# Altium schematic sheet Microcontroller.SchDoc
size A4; SheetNumber: 3; SheetTotal: 4
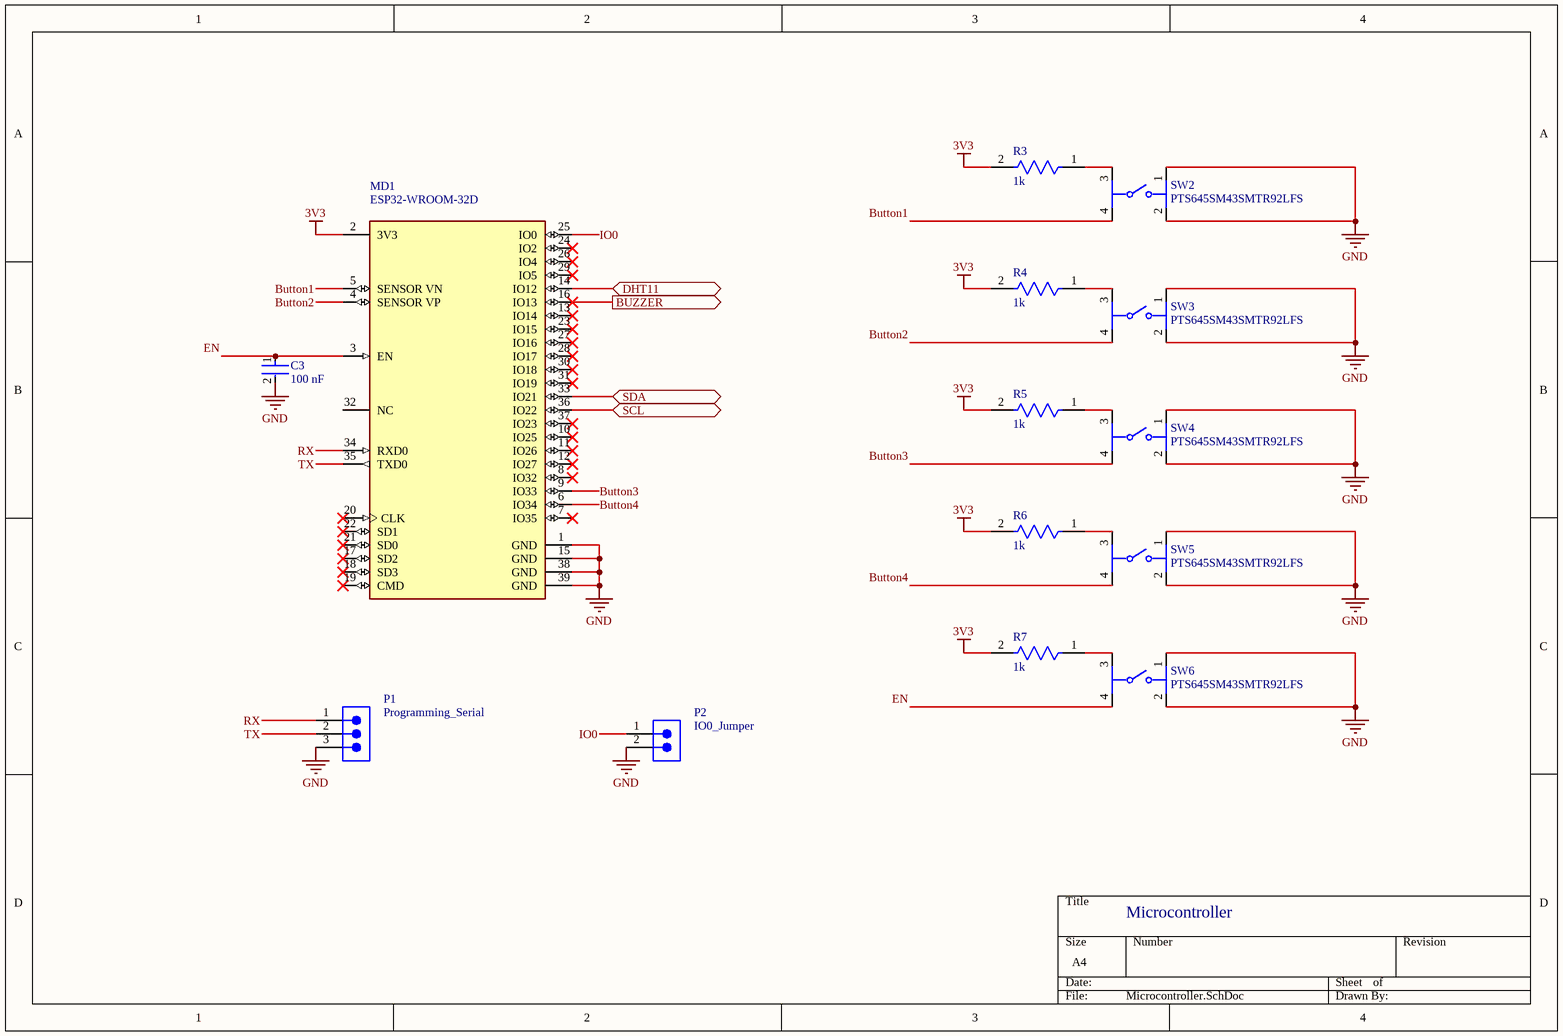
[diagram p0: Microcontroller.SchDoc]

## Parts
C3  100 nF  [FP-CC1206-1_25-MFG]
MD1  ESP32-WROOM-32D  [FP-ESP32-WROOM-32D-MFG]
P1  Programming_Serial  [61900311121]
P2  IO0_Jumper  [61300211121]
R3  1k  [FP-CRCW1206-e3-MFG]
R4  1k  [FP-CRCW1206-e3-MFG]
R5  1k  [FP-CRCW1206-e3-MFG]
R6  1k  [FP-CRCW1206-e3-MFG]
R7  1k  [FP-CRCW1206-e3-MFG]
SW2  PTS645SM43SMTR92LFS  [FP-PTS645SM43SMTR92LFS-MFG]
SW3  PTS645SM43SMTR92LFS  [FP-PTS645SM43SMTR92LFS-MFG]
SW4  PTS645SM43SMTR92LFS  [FP-PTS645SM43SMTR92LFS-MFG]
SW5  PTS645SM43SMTR92LFS  [FP-PTS645SM43SMTR92LFS-MFG]
SW6  PTS645SM43SMTR92LFS  [FP-PTS645SM43SMTR92LFS-MFG]

## Ports
BUZZER (out, see Sensors_Actuators[3B]), DHT11 (bidir, see Sensors_Actuators[1C]), SCL (bidir, see Sensors_Actuators[1B]), SDA (bidir, see Sensors_Actuators[1A])

## Nets
3V3: MD1.2(3V3) R3.2 R4.2 R5.2 R6.2 R7.2
GND: C3.2 MD1.1(GND) MD1.15(GND) MD1.38(GND) MD1.39(GND) P1.3 P2.2 SW2.1 SW2.2 SW3.1 SW3.2 SW4.1 SW4.2 SW5.1 SW5.2 SW6.1 SW6.2
Button1: MD1.5(SENSOR_VN) SW2.4
Button2: MD1.4(SENSOR_VP) SW3.4
Button3: MD1.9(IO33) SW4.4
Button4: MD1.6(IO34) SW5.4
BUZZER: MD1.16(IO13) ; port BUZZER
DHT11: MD1.14(IO12) ; port DHT11
EN: C3.1 MD1.3(EN) SW6.4
IO0: MD1.25(IO0) P2.1
RX: MD1.34(RXD0) P1.1
SCL: MD1.36(IO22) ; port SCL
SDA: MD1.33(IO21) ; port SDA
TX: MD1.35(TXD0) P1.2
NetR3_1: R3.1 SW2.3
NetR4_1: R4.1 SW3.3
NetR5_1: R5.1 SW4.3
NetR6_1: R6.1 SW5.3
NetR7_1: R7.1 SW6.3

Not connected (* = marked no-connect by the designer): MD1 7(IO35)* 8(IO32)* 10(IO25)* 11(IO26)* 12(IO27)* 13(IO14)* 17(SD2)* 18(SD3)* 19(CMD)* 20(CLK)* 21(SD0)* 22(SD1)* 23(IO15)* 24(IO2)* 26(IO4)* 27(IO16)* 28(IO17)* 29(IO5)* 30(IO18)* 31(IO19)* 32(NC) 37(IO23)*

## Notes on the sheet
- Microcontroller

## Library data of the parts
C3 = CMP-03422-000842-1: CAP CER 0.1UF 50V X7R 1206; Manufacturer: Yageo; Manufacturer Part Number: CC1206KRX7R9BB104; Automotive Grade: NA; Tolerance: 0.1; Material: Ceramic; Temperature Coefficient: 15%; Temperature Characteristic: X7R; Device Class L1: Passive Components; Lead Free: Yes; Octopart: https://octopart.com/cc1206krx7r9bb104-yageo-39467816; Category: Cap; Value: 100 nF; Temperature Range Low: -55°C; Device Class L3: Ceramic Capacitors; Voltage Rating: 50 V; Temperature Range High: +125°C; Device Class L2: Capacitors; RoHS: TRUE; Package: CC1206-1.25; Footprint Url: http://www.yageo.com/exep/pages/download/literatures/UPY-C_GEN_24.pdf; ComponentLink2Description: Datasheet; Temperature: -55°C to +125°C; Capacitance: 100 nF; Digikey Description: CAP CER 0.1UF 50V X7R 1206; Height: 1.45mm; Automotive: No; Mouser Description: Multilayer Ceramic Capacitors MLCC - SMD/SMT 100nF 50V X7R 10%; ComponentLink2URL: http://www.yageo.com/documents/recent/UPY-NP0X7R_HV_1KV-to-3KV_11.pdf
MD1 = CMP-194065-000003-1: WIFI MODULE 32MBITS SPI FLASH; Manufacturer: Espressif Systems; Max Supply Voltage: 3.6V; Nominal Supply Current: 500mA; Max Frequency: 2484MHz; Number Of Adc Channels: 16; Number Of Gpio: 32; Interface: I2C,SPI,UART,Ethernet,I2S,Other; Data Rate: 150Mbits/s; Min Supply Voltage: 3V; Bandwidth: 72MHz; Sensitivity: -98dBm; Octopart: https://octopart.com/esp32-wroom-32d-espressif+systems-91040050; Package: ESP32-WROOM-32D; ComponentLink2URL: https://www.espressif.com/sites/default/files/documentation/esp32-wroom-32d_esp32-wroom-32u_datasheet_en.pdf; Lead Free: Yes; Category: UNK; Mouser Description: Wi-Fi/BT BLE Module ESP32-D0WD, SPI Flash, UART, P; Device Class L1: Integrated Circuits (ICs); RoHS: TRUE; Temperature Range Low: -40°C; ComponentLink2Description: Datasheet; Digikey Description: WIFI MODULE 32MBITS SPI FLASH; Height: 3.2mm; Temperature: -40°C to +85°C; Manufacturer Part Number: ESP32-WROOM-32D; Device Class L3: Transceivers; Device Class L2: RF Semiconductors and Devices; Temperature Range High: +85°C; Automotive: No
P1 = CMP-1502-00585-2: NexarPartId: 18818222; Current Rating: 3A; Voltage Rating: 250V; Number of Positions: 3; Insulation Resistance: 1GΩ; Gender: Male; Pitch: 2.54mm; Connector Type: Male Pin; Contact Resistance: 20mΩ; Termination: Through Hole; Width: 7.66mm; Contact Plating: Tin; Orientation: Vertical; Mount: Through Hole; Contact Gender: Male; Max Operating Temperature: 105°C; Length: 7.62mm; Number of Rows: 1; Height: 12.5mm; Lead Pitch: 2.54mm; Housing Material: Nylon; Color: Beige; Contact Material: Copper; Fastening Type: Friction; Min Operating Temperature: -40°C; Number of Contacts: 3; Number of Pins: 3; Flammability Rating: UL94 V-0; Contact Mating Length: 7.493mm; RoHS: Compliant; REACH SVHC: Unknown; Packaging: Bulk; Operating Supply Voltage: 250V
P2 = CMP-1712-00002-6: NexarPartId: 20081794; Number of Contacts: 2; Pitch: 2.54mm; Connector Type: Male Pin; Voltage Rating: 250V; Current Rating: 3A; Gender: Male; Contact Resistance: 20mΩ; Height: 8.94mm; Lead Free: Lead Free; Number of Pins: 2; Termination: Through Hole; RoHS: Compliant; Lead Pitch: 2.54mm; REACH SVHC: No SVHC; Housing Material: PBT; Contact Mating Length: 5.9944mm; Min Operating Temperature: -40°C; Orientation: Vertical; Contact Material: Copper; Contact Gender: Male; Max Operating Temperature: 125°C; Number of Rows: 1; Number of Positions: 2; Packaging: Bulk; Contact Plating: Gold; Mount: Through Hole; Color: Black; Operating Supply Voltage: 250V
R3-R7 = CMP-2003-01876-2: RES Thick Film, 1.2kΩ, 1%, 0.25W, 100ppm/°C, 1206; Voltage Rating (DC): 200V; Power Rating: 250mW; Resistance: 1.2kR; Temperature Coefficient: 100ppm/°C; Features: Automotive AEC-Q200; Lead Free: Lead Free; Termination: SMD/SMT; Composition: Thick Film; Length: 3.2mm; Width: 0.063inch; Case Code (Imperial): 1206; Contact Plating: Tin; Number of Terminations: 2; Height: 0.55mm; Depth: 1.6mm; Max Operating Temperature: 155°C; Tolerance: 1%; Case/Package: 1206; Voltage Rating: 200V; Case Code (Metric): 3216; Packaging: Tape and Reel; Weight: 0.000353oz; Package Quantity: 10; Max Power Dissipation: 250mW; Min Operating Temperature: -55°C; Working Voltage: 200V; Radiation Hardening: No; Military Standard: Not
SW2-SW6 = CMP-2000-05160-2: SWITCH TACTILE SPST-NO 0.05A 12V; Contact Resistance: 100mR; Throw Configuration: SPST; Illumination Type: Non-Illuminated; Mechanical Life: 100000Cycles; Current Rating: 50mA; Switch Function: Off-Mom; Actuator Length: 0.85mm; Actuator Material: Nylon; Actuator Type: Standard; Operating Force: 160gf; Min Operating Temperature: -20°C; REACH SVHC: No SVHC; Termination: Gull Wing; Case/Package: SMD/SMT; Packaging: Tape and Reel; Mount: Surface Mount; Voltage Rating (DC): 12V; Orientation: Straight; Lead Free: Lead Free; Contact Material: Silver; Color: Black; Max Current Rating: 50mA; Contact Plating: Silver; Depth: 9mm; Package Quantity: 1; Max Voltage Rating (DC): 12V; Length: 6mm; Max Operating Temperature: 60°C